# EAGLE design FREZZ_V031 (EAGLE 7.5.0)

## Sheet 1 of 2
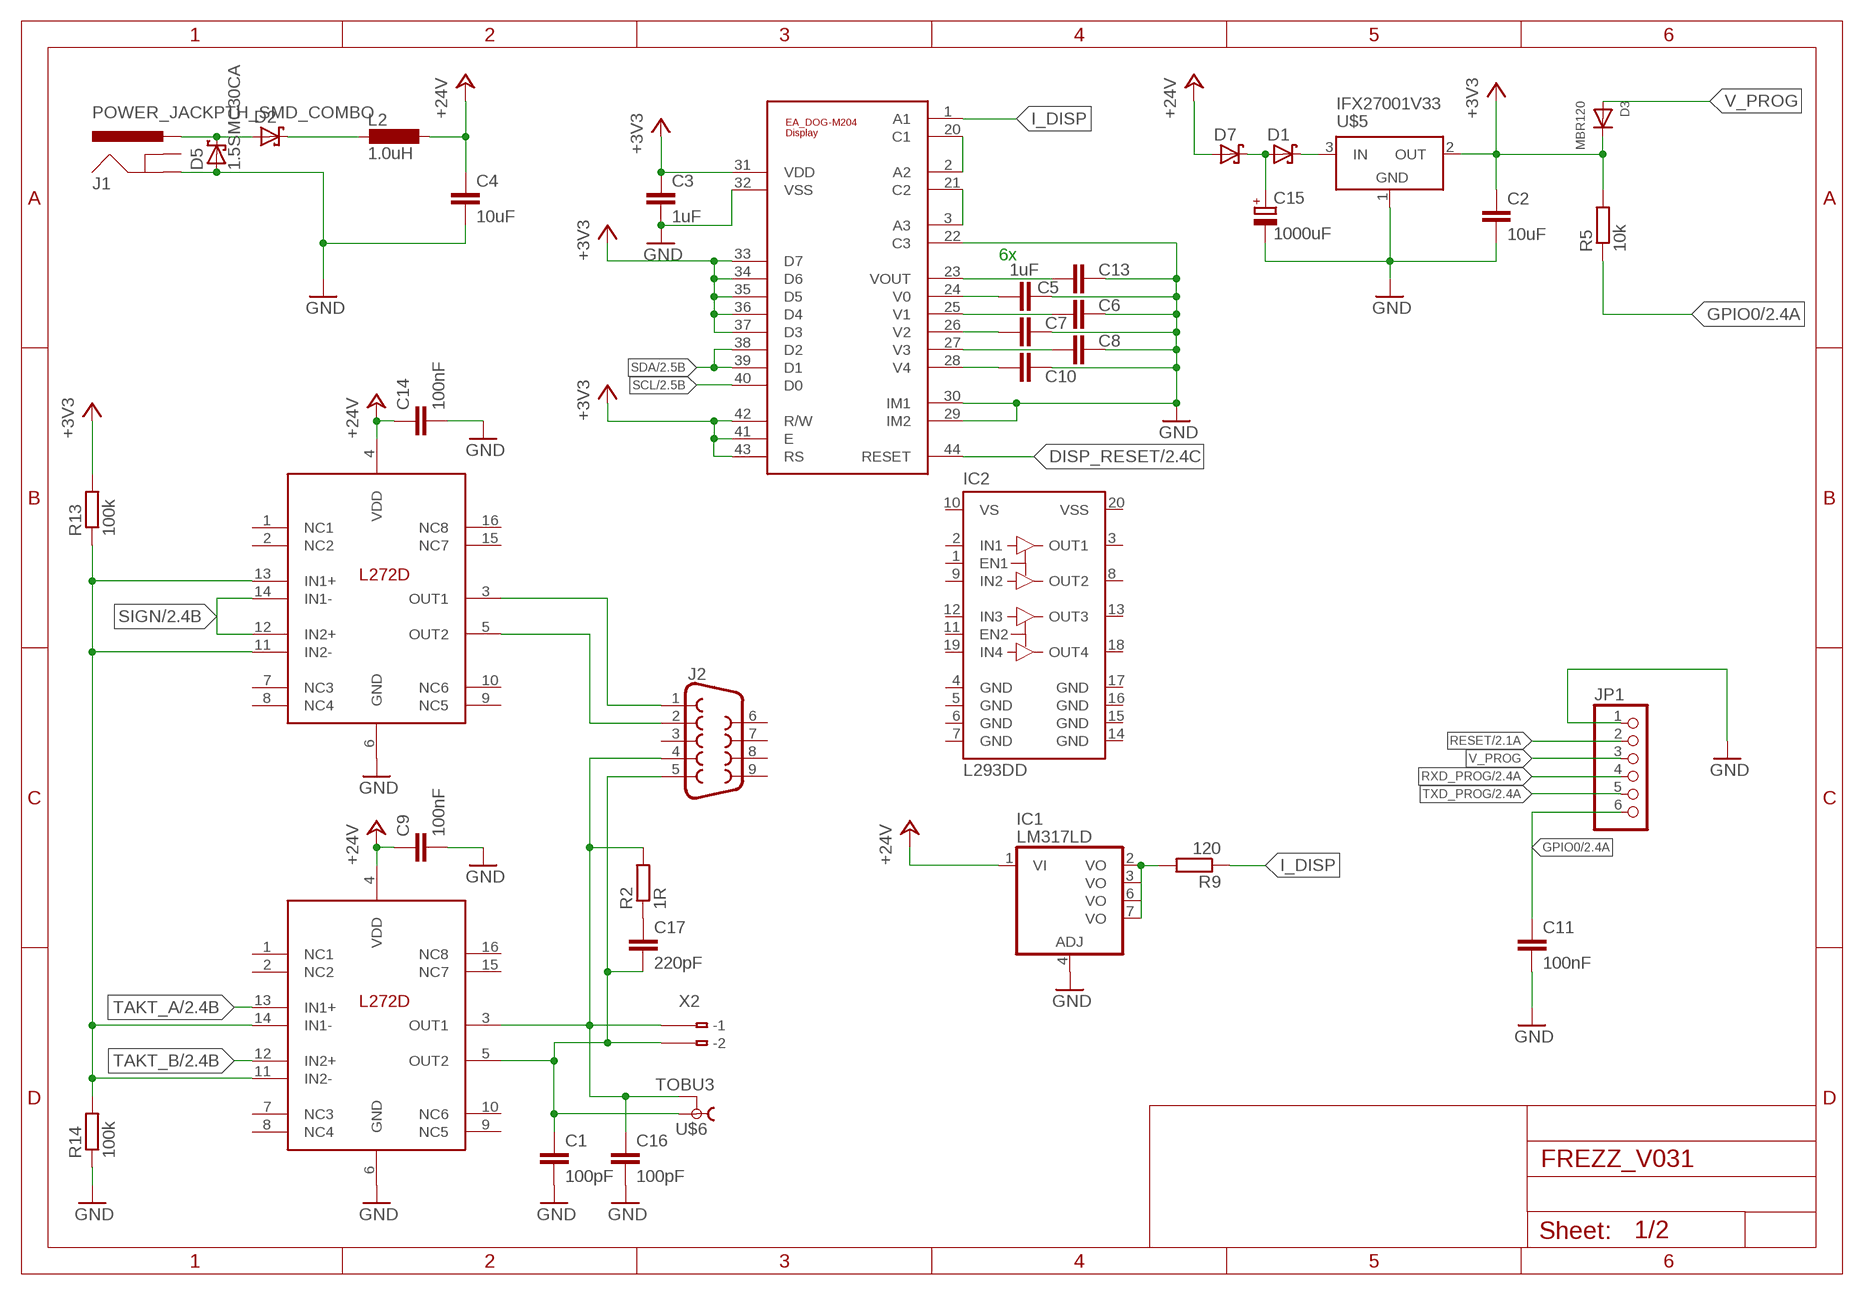
[diagram p0: schematic, sheet 1]

### Parts
C1  100pF  C-EUC0603K  [C0603K]
C2  10uF  C-EUC0603K  [C0603K]
C3  1uF  C-EUC0603K  [C0603K]
C4  10uF  C-EUC1210K  [C1210K]
C5  1uF  C-EUC0603K  [C0603K]
C6  1uF  C-EUC0603K  [C0603K]
C7  1uF  C-EUC0603K  [C0603K]
C8  1uF  C-EUC0603K  [C0603K]
C9  100nF  C-EUC0603K  [C0603K]
C10  1uF  C-EUC0603K  [C0603K]
C11  100nF  C-EUC0603K  [C0603K]
C13  1uF  C-EUC0603K  [C0603K]
C14  100nF  C-EUC0603K  [C0603K]
C15  1000uF  CPOL-EUG  [PANASONIC_G]
C16  100pF  C-EUC0603K  [C0603K]
C17  220pF  C-EUC0603K  [C0603K]
D1  SCHOTTKY-DIODESMD  [SMB]
D2  SCHOTTKY-DIODESMD  [SMB]
D3  MBR120  DIODESOD-123  [SOD-123]
D5  1.5SMC30CA  SCHOTTKY-DIODESMC  [SMC]
D7  SCHOTTKY-DIODESMD  [SMB]
IC1  LM317LD  [SO08]
IC2  L293DD  [SO20]
J1  POWER_JACKPTH_SMD_COMBO  [POWER_JACK_COMBO]
J2  DB9FEMALE  [DB9]
JP1  PINHD-1X6  [1X06]
L2  1.0uH  L-EUL3230M  [L3230M]
R2  1R  R-EU_M1206  [M1206]
R5  10k  R-EU_M1206  [M1206]
R9  120  R-EU_M1206  [M1206]
R13  100k  R-EU_M1206  [M1206]
R14  100k  R-EU_M1206  [M1206]
U$1  EA_DOG-M204-DISPLAY  [E_DOG-M204_DISPLAY]
U$2  L272D  [SO16]
U$3  L272D  [SO16]
U$5  IFX27001V33  IFX27001  [TO252]
U$6  TOBU3  TOBU3-REICHELT  [TOBU3-REICHELT]
X2  233-102  [233-102]

### Nets
$N122 [Power]: D1.C U$5.3(IN)
+3V3 [Power]: C2.1 C3.1 D3.C R5.2 R13.2 U$1.31(VDD) U$1.33(D7) U$1.34(D6) U$1.35(D5) U$1.36(D4) U$1.37(D3) U$1.41(E) U$1.42(R/W) U$1.43(RS) U$5.2(OUT) ; also sheet 2
+24V [Power]: C4.1 C9.1 C14.1 D7.A IC1.1(VI) L2.1 U$2.4(VDD) U$3.4(VDD) ; also sheet 2
DISP_RESET: U$1.44(RESET) ; also sheet 2
GND [Power]: C1.2 C2.2 C3.2 C4.2 C5.1 C6.1 C7.1 C8.1 C9.2 C10.1 C11.2 C13.1 C14.2 C15.- C16.2 D5.A IC1.4(ADJ) J1.GND@1(GND) JP1.1 R14.1 U$1.22(C3) U$1.29(IM2) U$1.30(IM1) U$1.32(VSS) U$2.6(GND) U$3.6(GND) U$5.1(GND) ; also sheet 2
GPIO0: C11.1 JP1.6 R5.1 ; also sheet 2
I_DISP: R9.1 U$1.1(A1)
N$4: C13.2 U$1.23(VOUT)
N$5 [Power]: D2.A D5.C J1.POWER(PWR)
N$6: C5.2 U$1.24(V0)
N$7 [Power]: D2.C L2.2
N$8 [Power]: C15.+ D1.A D7.C
N$9: C17.1 R2.1
N$11 [Power]: C16.1 J2.4 R2.2 U$2.3(OUT1) U$6.2 U$6.2@1 U$6.2@2 X2.B1(B-1)
N$12: C6.2 U$1.25(V1)
N$13 [Power]: C1.1 C17.2 J2.5 U$2.5(OUT2) U$6.1 X2.B2(B-2)
N$15: C7.2 U$1.26(V2)
N$16: C8.2 U$1.27(V3)
N$21: C10.2 U$1.28(V4)
N$22: U$1.3(A3) U$1.21(C2)
N$23: U$1.2(A2) U$1.20(C1)
N$24: IC1.2(VO) IC1.3(VO) IC1.6(VO) IC1.7(VO) R9.2
N$26: J2.1 U$3.3(OUT1)
N$27: J2.2 U$3.5(OUT2)
N$38: R13.1 R14.2 U$2.11(IN2-) U$2.14(IN1-) U$3.11(IN2-) U$3.13(IN1+)
RESET: JP1.2 ; also sheet 2
RXD_PROG: JP1.4 ; also sheet 2
SCL: U$1.40(D0) ; also sheet 2
SDA: U$1.38(D2) U$1.39(D1) ; also sheet 2
SIGN: U$3.12(IN2+) U$3.14(IN1-) ; also sheet 2
TAKT_A: U$2.13(IN1+) ; also sheet 2
TAKT_B: U$2.12(IN2+) ; also sheet 2
TXD_PROG: JP1.5 ; also sheet 2
V_PROG: D3.A JP1.3
Unconnected: IC2.1(EN1) IC2.2(IN1) IC2.3(OUT1) IC2.8(OUT2) IC2.9(IN2) IC2.11(EN2) IC2.12(IN3) IC2.13(OUT3) IC2.18(OUT4) IC2.19(IN4) J1.GND(GNDBREAK) J2.3 J2.6 J2.7 J2.8 J2.9 U$2.1(NC1) U$2.2(NC2) U$2.7(NC3) U$2.8(NC4) U$2.9(NC5) U$2.10(NC6) U$2.15(NC7) U$2.16(NC8) U$3.1(NC1) U$3.2(NC2) U$3.7(NC3) U$3.8(NC4) U$3.9(NC5) U$3.10(NC6) U$3.15(NC7) U$3.16(NC8) X2.A1(-1) X2.A2(-2)

### Notes on the sheet
- 6x

## Sheet 2 of 2
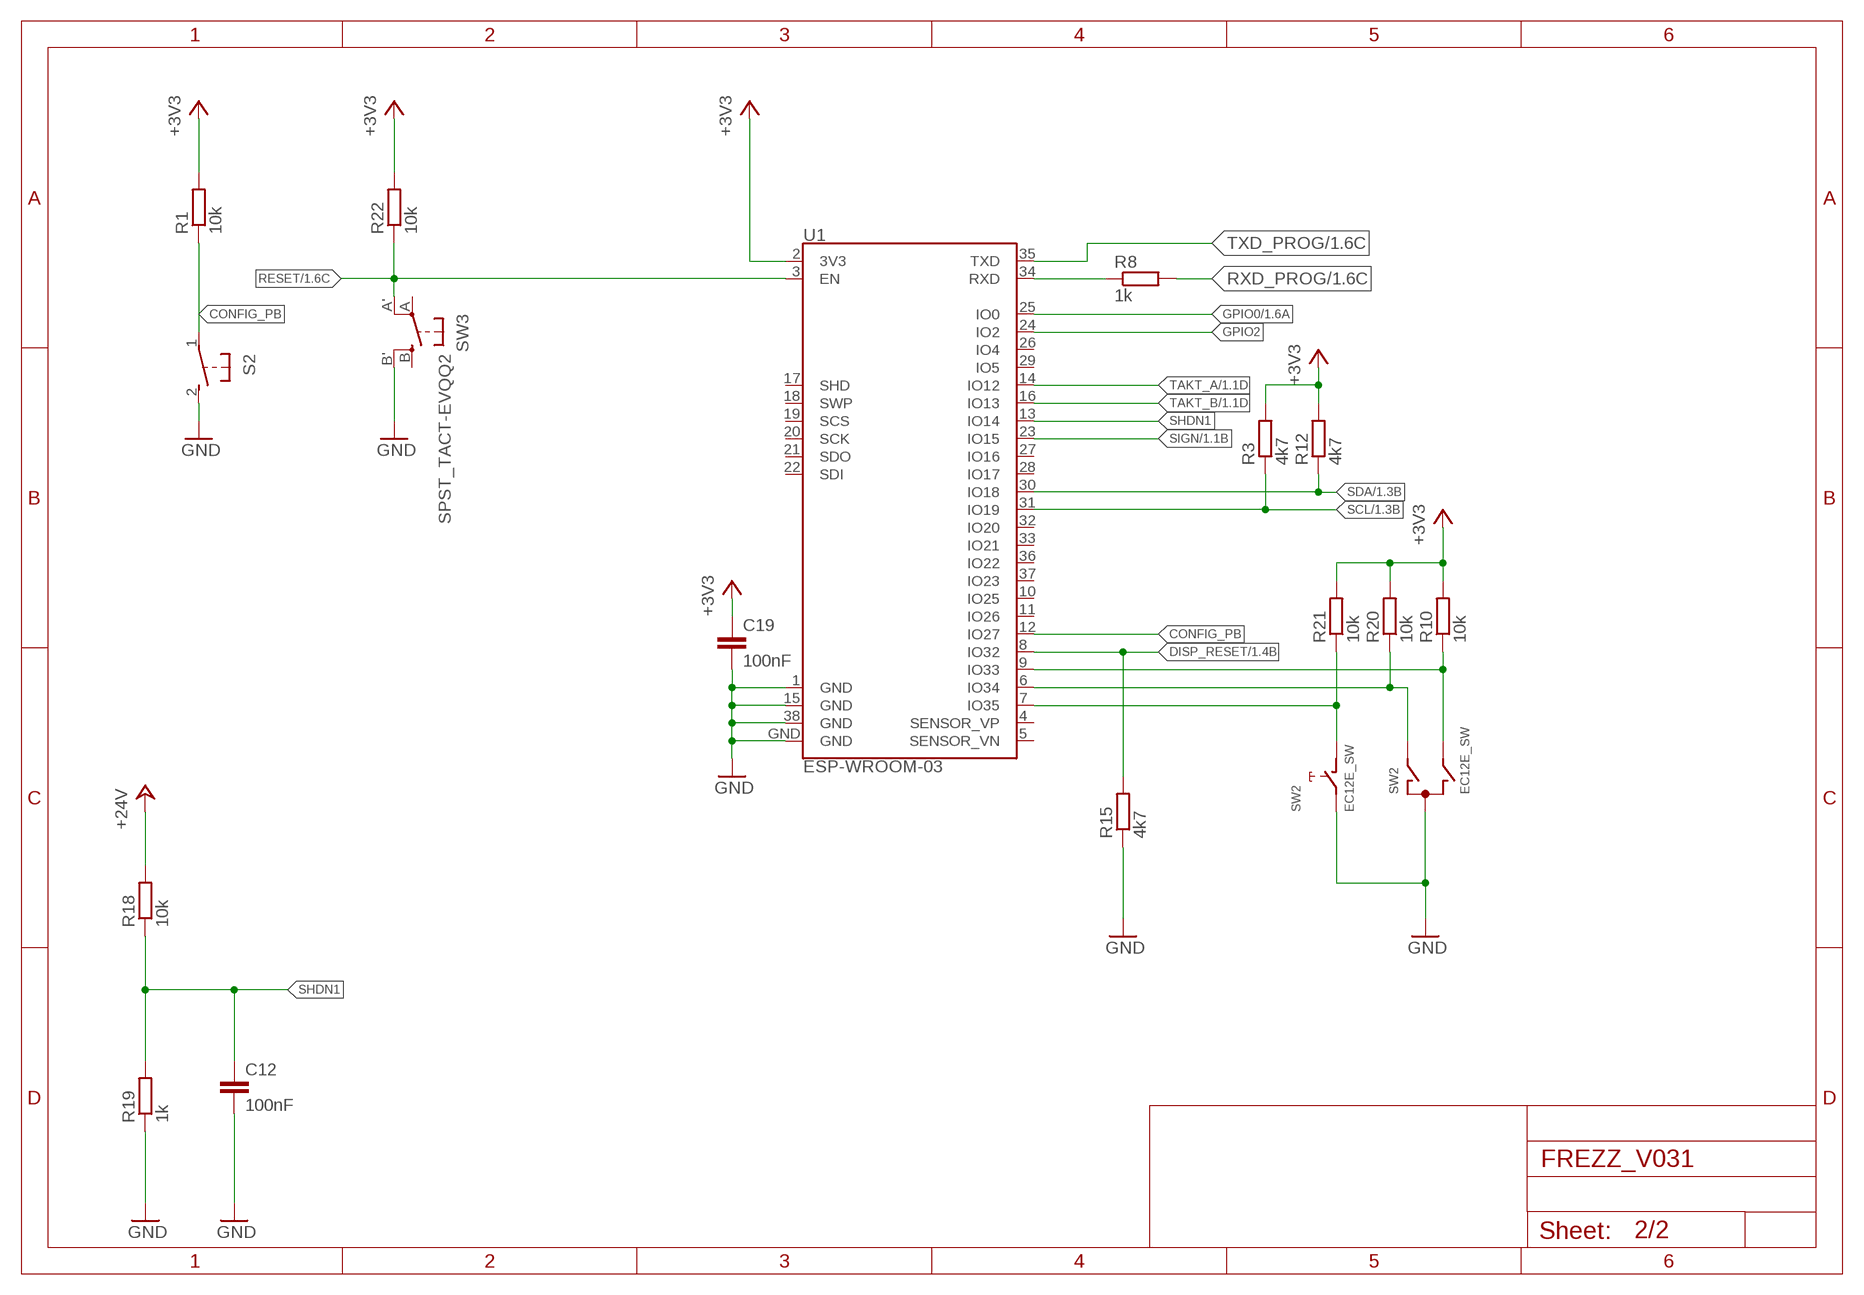
[diagram p1: schematic, sheet 2]

### Parts
C12  100nF  C-EUC0603K  [C0603K]
C19  100nF  C-EUC0603K  [C0603K]
R1  10k  R-EU_M1206  [M1206]
R3  4k7  R-EU_M1206  [M1206]
R8  1k  R-EU_M1206  [M1206]
R10  10k  R-EU_M1206  [M1206]
R12  4k7  R-EU_M1206  [M1206]
R15  4k7  R-EU_M1206  [M1206]
R18  10k  R-EU_M1206  [M1206]
R19  1k  R-EU_M1206  [M1206]
R20  10k  R-EU_M1206  [M1206]
R21  10k  R-EU_M1206  [M1206]
R22  10k  R-EU_M1206  [M1206]
S2  31-XX  [B3F-31XX]
SW2  EC12E_SW  [ALPS_EC12E_SW]
SW3  SPST_TACT-EVQQ2  [EVQ-Q2]
U1  ESP-WROOM-03  [ESP-WROOM-03]

### Nets
+3V3 [Power]: C19.1 R1.2 R3.2 R10.2 R12.2 R20.2 R21.2 R22.2 U1.2(3V3) ; also sheet 1
+24V [Power]: R18.2 ; also sheet 1
CONFIG_PB: R1.1 S2.1(P) U1.12(IO27)
DISP_RESET: R15.2 U1.8(IO32) ; also sheet 1
GND [Power]: C12.2 C19.2 R15.1 R19.1 S2.2(S) SW2.C SW2.E SW3.B'(S1) U1.1(GND) U1.15(GND) U1.38(GND) U1.GND ; also sheet 1
GPIO0: U1.25(IO0) ; also sheet 1
N$31: R21.1 SW2.D U1.7(IO35)
N$33: R8.1 U1.34(RXD)
N$34: R10.1 SW2.B U1.9(IO33)
N$37: R20.1 SW2.A U1.6(IO34)
RESET: R22.1 SW3.A'(P1) U1.3(EN) ; also sheet 1
RXD_PROG: R8.2 ; also sheet 1
SCL: R3.1 U1.31(IO19) ; also sheet 1
SDA: R12.1 U1.30(IO18) ; also sheet 1
SHDN1: C12.1 R18.1 R19.2 U1.13(IO14)
SIGN: U1.23(IO15) ; also sheet 1
TAKT_A: U1.14(IO12) ; also sheet 1
TAKT_B: U1.16(IO13) ; also sheet 1
TXD_PROG: U1.35(TXD) ; also sheet 1
Unconnected: SW2.GND1(G) SW2.GND2(G) SW3.A(P) SW3.B(S) U1.4(SENSOR_VP) U1.5(SENSOR_VN) U1.10(IO25) U1.11(IO26) U1.17(SHD) U1.18(SWP) U1.19(SCS) U1.20(SCK) U1.21(SDO) U1.22(SDI) U1.24(IO2) U1.26(IO4) U1.27(IO16) U1.28(IO17) U1.29(IO5) U1.32(IO20) U1.33(IO21) U1.36(IO22) U1.37(IO23)

## Power pins joined to a net without a drawn wire
GND: IC2.4(GND) IC2.5(GND) IC2.6(GND) IC2.7(GND) IC2.14(GND) IC2.15(GND) IC2.16(GND) IC2.17(GND)
VS: IC2.10(VS)
VSS: IC2.20(VSS)

## Library data of the parts
C1-C14 C16 C17 C19 = rcl:C-EU: CAPACITOR, European symbol
C15 = rcl:CPOL-EU: POLARIZED CAPACITOR, European symbol
D1 D2 D5 D7 = diode:SCHOTTKY-DIODE: Schottky Diode
D3 = adafruit:DIODE: Diode SMADIODE - SMA Surface Mount Package 20V 1A Schottky Diode Digikey: 641-1014-6-ND DO-1N4148 - Through Hole Small Current Diode SOD-123 20V 1 A (.5mV Vf) Schottky Diode - Digikey: MBRX120TPMSCT-ND SOD-323 10V 570mA (.38mV Vf, 3ns) Schottky Diode - Digikey: ZLLS410CT-ND SOD-523 30V 30mA Schottky Diode (RB751S-40TE61) - Digikey: RB751S-40TE61CT-ND SOT23-R/W - SOT23 Package (R = Solder Paste/Reflow Ovens, W = Hand-Soldering) BAT54Film 40V 300mA - Digikey: 497-7162-1-ND
IC1 = linear:LM317LD: LOW CURRENT 1.2 TO 37V ADJUSTABLE VOLTAGE REGULATOR Source: http://pdf.alldatasheet.com
IC2 = st-microelectronics:L293DD: PUSH-PULL FOUR CHANNEL DRIVER WITH DIODES Source: http://www.st.com/stonline/books/pdf/docs/1330.pdf; OC_FARNELL: unknown
J1 = SparkFun-Connectors:POWER_JACK: Power Jack Connector This is the standard 5.5mm barrel jack for power. The PTH is the most common, proven, reliable, footprint. The Slot footprint only works if the mill layer is transmitted to the PCB fab house so be warned. Here are the connectors we sell at SparkFun: DC Barrel Power Jack/Connector <https://www.sparkfun.com/products/119> (PRT-00119) DC Barrel Power Jack/Connector (SMD) <https://www.sparkfun.com/products/12748> (PRT-12748) DC Barrel Jack Adapter - Breadboard Compatible <https://www.sparkfun.com/products/10811> (PRT-10811) It is used on this SparkFun product (and many, many others): SparkFun RedBoard - Programmed with Arduino <https://www.sparkfun.com/products/12757> (DEV-12757) Also, if you need a mating power supply or connector, please check these out: Wall Adapter Power Supply - 9VDC 650mA <https://www.sparkfun.com/products/298> (TOL-00298) DC Barrel Jack Adapter - Male <https://www.sparkfun.com/products/10287> (PRT-10287)
J2 = SparkFun-Connectors:DB9: DB9 Connector Standard DB9 (D-Sub 9) serial connector. Can be used for CAN bus as well as RS485 and RS232. Footprint production proven. Here is the female version connector we sell at SparkFun: 9 Pin Female Serial Connector - PCB Mount <https://www.sparkfun.com/products/429> (PRT-00429) This connector has been used on the following SparkFun products: SparkFun RS232 Shifter - SMD <https://www.sparkfun.com/products/449> (PRT-00449) SparkFun RS232 Shifter SMD (No DB9) <https://www.sparkfun.com/products/8780> (PRT-08780); PROD_ID: CONN-08194
JP1 = adafruit:PINHD-1X6: PIN HEADER
L2 = rcl:L-EU: INDUCTOR, European symbol
R1-R3 R5 R8-R10 R12-R15 R18-R22 = resistor:R-EU_: RESISTOR, European symbol
S2 = switch-omron:31-XX: OMRON SWITCH; MPN: B3F-3100; OC_FARNELL: 959704; OC_NEWARK: 36M3582
SW2 = switch-alps:EC12E_SW: ALPS rotary Encoder EC12E series with switch; MPN: EC12E2424407; OC_FARNELL: 1520813; OC_NEWARK: 74M1068
SW3 = adafruit:SPST_TACT: SMT 6mm switch, EVQQ2 series http://www.ladyada.net/library/eagle
U1 = esp32:ESP-WROOM-03
U$1 = display_ea_dog-m:EA_DOG-M204-DISPLAY
U$2 U$3 = adafruit:L272D
U$5 = MeineLIB:IFX27001
U$6 = con-hirschmann:TOBU3-REICHELT
X2 = con-wago:233-102: WAGO Cage Clamp; MPN: 233-102; OC_FARNELL: unknown; OC_NEWARK: 28K9044

## Net classes
0 default: width 0.102 mm, drill 0.076 mm, clearance 0.051 mm
1 Power: width 1.016 mm, drill 0.076 mm, clearance 0.051 mm to class 0, clearance 0.051 mm
2 24V: width 0.127 mm, drill 0.076 mm, clearance 0.051 mm to class 0, clearance 0.051 mm to class 1, clearance 0.051 mm

## Board
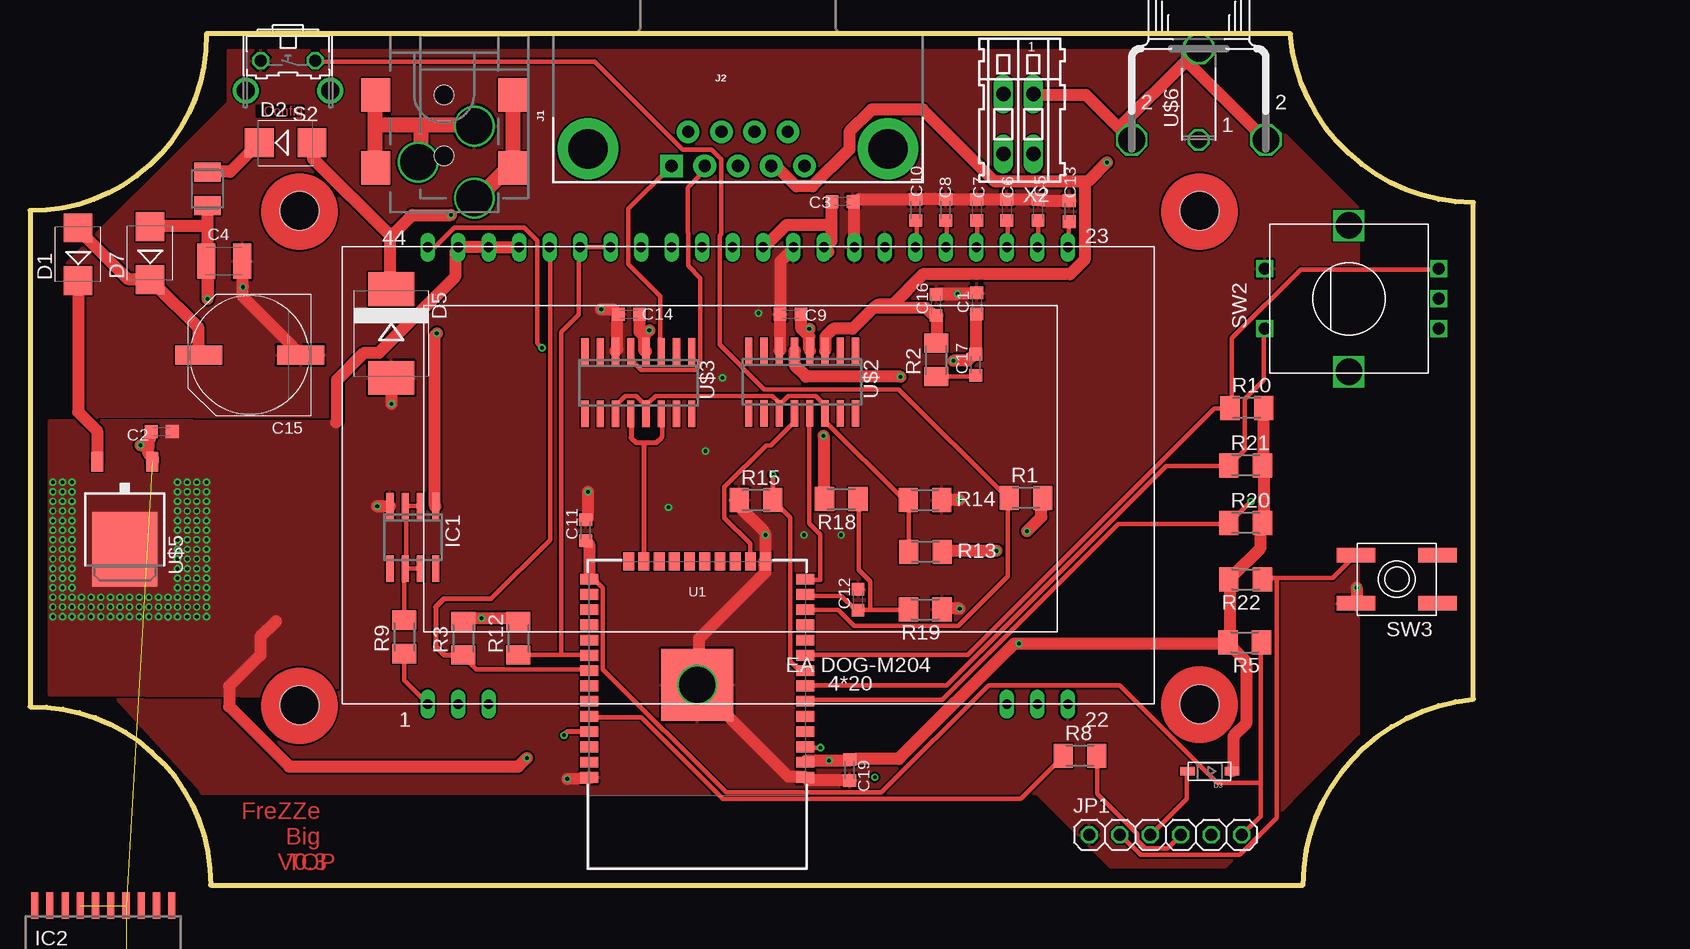
[diagram p2: board, top side]
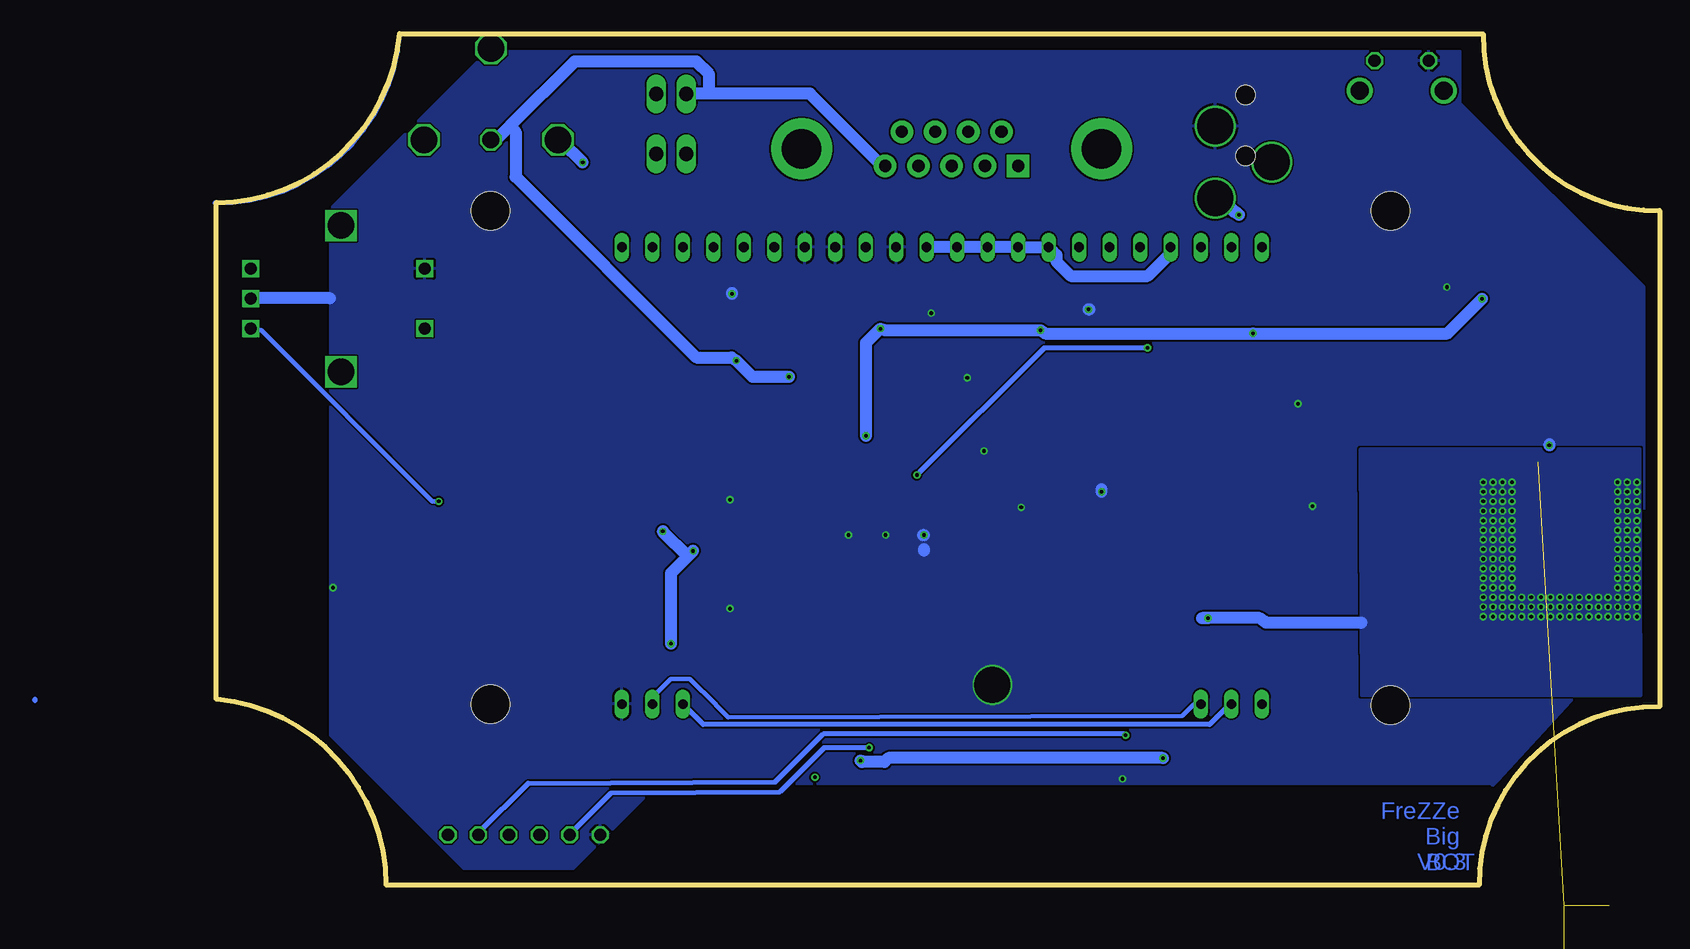
[diagram p3: board, bottom side, seen from below]

Size 120.28 x 71 mm. Coordinates in mm from the lower left corner, seen from the top.
Outline: 106.08,0 15.05,0 arc92 0,14.88 0,56.25 arc92 14.7,70.95
Outline: 120.28,15.49 120.28,56.93
Outline: 105.02,70.98 14.7,70.98
Outline: 120.2,56.9 arc-84 105,71
Outline: 106.1,0 arc-84 120.2,15.5
Copper layers (1+16): Top 0.035mm / dielectric 0.36mm / Bottom 0.035mm
Design rules "PCB-Joker-Eagle-DRU-v1-0 3 *": minimum track width 15mil, minimum drill 0.3mm, track to track 6mil, track to pad 6mil, pad to pad 6mil, via to via 6mil, smd to smd 6mil, copper to edge 0mil, drill to drill 10mil, minimum pad ring 8mil, minimum via ring 6mil, stop-mask expansion 3mil, vias tented up to drill 0mil, thermal gap 8mil
Holes 3.2 mm at 97.45,15.11 97.45,56.21 22.45,56.21 22.45,15.01
tKeepout: area 46.5,0.2 to 64.7,7.9
bKeepout: area 46.5,0.1 to 64.7,7.8; area 96.2,13.8 to 98.7,16.3; area 96.2,54.9 to 98.7,57.4; area 21.2,54.9 to 23.7,57.4; area 21.2,13.7 to 23.7,16.2

### Footprints (pad centres in the part's own frame; a part is rotated, then mirrored left to right if it is on the bottom)
C0603K = smd 1.05 x 1.08: 1 -0.875,0; 2 0.875,0
C1210K = smd 1.5 x 2.9: 1 -1.5,0; 2 1.5,0
PANASONIC_G = smd 3.9 x 1.6: + 4.25,0; - -4.25,0
SMB = smd 2.4 x 2.4: A 2.2,0; C -2.2,0
SOD-123 = smd 1.2 x 0.7: A 1.85,0; C -1.85,0
SMC = smd 2.8 x 3.8: A 3.7,0; C -3.7,0
SO08 = smd 0.6 x 2.2: 1 -1.905,-2.6; 2 -0.635,-2.6; 3 0.635,-2.6; 4 1.905,-2.6; 5 1.905,2.6; 6 0.635,2.6; 7 -0.635,2.6; 8 -1.905,2.6
SO20 = smd 0.6 x 2.2: 1 -5.715,-4.6; 2 -4.445,-4.6; 3 -3.175,-4.6; 4 -1.905,-4.6; 5 -0.635,-4.6; 6 0.635,-4.6; 7 1.905,-4.6; 8 3.175,-4.6; 9 4.445,-4.6; 10 5.715,-4.6; 11 5.715,4.6; 12 4.445,4.6; 13 3.175,4.6; 14 1.905,4.6; 15 0.635,4.6; 16 -0.635,4.6; 17 -1.905,4.6; 18 -3.175,4.6; 19 -4.445,4.6; 20 -5.715,4.6
POWER_JACK_COMBO = drill 2.997: GND 5.62,-2.16; GND@1 2.62,2.54; POWER 8.62,2.54 | smd 2.8 x 2.4: GND@3 0,-5.7; GND@4 6.1,-5.7; POWER@1 0,5.7; POWER@2 6.1,5.7 | hole 1.6: 0,0; 5.08,0
DB9 = drill 1.016 pad 1.88 square: 1 -5.54,-1.42 | drill 1.016 pad 1.88: 2 -2.77,-1.42; 3 0,-1.42; 4 2.77,-1.42; 5 5.54,-1.42; 6 -4.15,1.42; 7 -1.38,1.42; 8 1.38,1.42; 9 4.15,1.42 | drill 3.302 pad 5.08: G1 -12.5,0; G2 12.5,0
1X06 = drill 1.016 octagon: 1 -6.35,0; 2 -3.81,0; 3 -1.27,0; 4 1.27,0; 5 3.81,0; 6 6.35,0
L3230M = smd 1.6 x 2.2: 1 -1.4,0; 2 1.4,0
M1206 = smd 1.6 x 2: 1 -1.4,0; 2 1.4,0
B3F-31XX = drill 1.016 octagon: 1 -2.261,-1.245; 2 2.261,-1.245 | drill 1.499 pad 2.159: 3 -3.505,1.245; 4 3.505,1.245
ALPS_EC12E_SW = drill 1 square: A -2.5,-7.5; B 2.5,-7.5; C 0,-7.5; D -2.5,7; E 2.5,7 | drill 2.2 square: GND1 -6.1,0; GND2 6.1,0
EVQ-Q2 = smd 3.2 x 1.2: A -3.4,-2; A' 3.4,-2; B -3.4,2; B' 3.4,2
ESP-WROOM-03 = smd 0.9 x 1.5: 1 7.7,9; 2 6.43,9; 3 5.16,9; 4 3.89,9; 5 2.62,9; 6 1.35,9; 7 0.08,9; 8 -1.19,9; 9 -2.46,9; 10 -3.73,9; 11 -5,9; 12 -6.27,9; 13 -7.54,9; 14 -8.81,9; 25 -8.81,-9; 26 -7.54,-9; 27 -6.27,-9; 28 -5,-9; 29 -3.73,-9; 30 -2.46,-9; 31 -1.19,-9; 32 0.08,-9; 33 1.35,-9; 34 2.62,-9; 35 3.89,-9; 36 5.16,-9; 37 6.43,-9; 38 7.7,-9 | smd 1.5 x 0.9: 15 -10.3,5.715; 16 -10.3,4.445; 17 -10.3,3.175; 18 -10.3,1.905; 19 -10.3,0.635; 20 -10.3,-0.635; 21 -10.3,-1.905; 22 -10.3,-3.175; 23 -10.3,-4.445; 24 -10.3,-5.715 | smd 6 x 6: GND 0,0
E_DOG-M204_DISPLAY = drill 0.8 long: 1 7.144,0; 2 9.684,0; 3 12.224,0; 20 55.404,0; 21 57.944,0; 22 60.484,0; 23 60.484,38.1; 24 57.944,38.1; 25 55.404,38.1; 26 52.864,38.1; 27 50.324,38.1; 28 47.784,38.1; 29 45.244,38.1; 30 42.704,38.1; 31 40.164,38.1; 32 37.624,38.1; 33 35.084,38.1; 34 32.544,38.1; 35 30.004,38.1; 36 27.464,38.1; 37 24.924,38.1; 38 22.384,38.1; 39 19.844,38.1; 40 17.304,38.1; 41 14.764,38.1; 42 12.224,38.1; 43 9.684,38.1; 44 7.144,38.1
SO16 = smd 0.6 x 2.2: 1 -4.445,-2.6; 2 -3.175,-2.6; 3 -1.905,-2.6; 4 -0.635,-2.6; 5 0.635,-2.6; 6 1.905,-2.6; 7 3.175,-2.6; 8 4.445,-2.6; 9 4.445,2.6; 10 3.175,2.6; 11 1.905,2.6; 12 0.635,2.6; 13 -0.635,2.6; 14 -1.905,2.6; 15 -3.175,2.6; 16 -4.445,2.6
TO252 = smd 1 x 1.6: 1 -2.28,-4.8; 3 2.28,-4.8 | smd 5.4 x 6.2: 2 0,2.5
TOBU3-REICHELT = drill 1.397 octagon: 1 0,-3.81 | drill 2.21 octagon: 2 5.588,-3.81; 2@1 -5.588,-3.81; 2@2 0,3.81
233-102 = drill 1.2 long: A1 -1.25,2.5; A2 1.25,2.5; B1 -1.25,-2.5; B2 1.25,-2.5

### Placement (x,y rotation side)
C1  78.9,48.5 90 top
C2  10.98,37.82 180 top
C3  67.7,57 0 top
C4  16.18,52.02 0 top
C5  84,56.3 270 top
C6  81.4,56.3 270 top
C7  78.9,56.3 270 top
C8  76.3,56.3 270 top
C9  63.38,47.6 180 top
C10  73.8,56.3 270 top
C11  46.3,29.6 90 top
C12  69,23.8 90 top
C13  86.6,56.2 270 top
C14  49.9,47.6 180 top
C15  18.3,44.2 180 top
C16  75.5,48.4 90 top
C17  78.8,43.4 90 top
C19  68.3,9.6 270 top
D1  4,52.6 90 top
D2  21.3,61.9 0 top
D3  98.3,9.5 180 top
D5  30.1,46 270 top
D7  10,52.7 90 top
IC1  31.9,29 180 top
IC2  6.1,-6.3 0 top
J1  34.5,65.9 270 top
J2  59,61.4 0 top
JP1  94.62,4.19 0 top
L2  14.78,58.05 90 top
R1  83,32.3 0 top
R2  75.5,43.8 90 top
R3  36.1,20.6 90 top
R5  101.22,20.25 180 top
R8  87.5,10.8 0 top
R9  31.2,20.7 90 top
R10  101.4,39.8 0 top
R12  40.7,20.6 90 top
R13  74.62,27.8 0 top
R14  74.58,32.13 180 top
R15  60.5,32.1 0 top
R18  67.6,32.2 180 top
R19  74.6,23 180 top
R20  101.3,30.2 0 top
R21  101.3,35 0 top
R22  101.3,25.5 180 top
S2  21.5,67.5 180 top
SW2  109.9,48.9 90 top
SW3  113.9,25.5 180 top
U1  55.6,16.7 270 top
U$1  26,15.1 0 top
U$2  64.35,41.96 180 top
U$3  50.7,41.9 180 top
U$5  7.9,30.5 180 top
U$6  97.4,65.95 0 top
X2  82.37,63.47 180 top

### Tracks (layer width: path | path; a pad name or v marks a point on that pad's centre or on a via)
$N122
  Top 0.381: 5.6,35.34 U$5.3 | 4,50.27 D1.C
  Top 1.016: 5.6,35.34 5.6,37.87 4,39.47 4,50.27
+3V3  (via drill 0.3, 0.6)
  Top 1.016: U1.2 64.67,10.4 v66.6,10.4 68.28,10.4 C19.1 68.81,10.54 72.41,10.54 82.01,20.14 v82.4,20.14 99.35,20.14 R5.2 | D3.C 100.28,9.6 100.28,12.4 101.35,13.47 101.35,18.67 99.88,20.14 R5.2 | U$1.41 40.67,53.21 38.67,53.21 U$1.42 38.14,53.21 35.74,53.21 U$1.43 35.47,52.81 35.47,50.81 29.07,44.41 27.87,44.41 25.6,42.14 25.6,38.67 25.5,38.6 | 36.01,22 R3.2 36.37,22.27 v37.64,22.27 40.43,22.27 R12.2 | 40.67,22 R12.2 | 66.81,55.07 66.81,53.74 66.28,53.21 U$1.31 66.54,52.81 | 66.81,55.07 66.81,56.94 C3.1 | v61.07,53.21 U$1.33 61.47,53.47 63.08,55.07 66.81,55.07 | v80.54,27.87 76.14,27.87 R13.2 | 20.5,22 19.2,20.7 19.2,19.2 16.6,16.6 16.6,14.9 21.6,9.9 40.7,9.9 v41.4,10.6 | R12.2 | R10.2 102.81,39.74 102.81,35.47 R21.2 102.81,34.94 102.81,30.27 R20.2 102.55,29.74 102.55,28.14 100.28,25.87 R22.2 100.01,25.47 100.01,20.67 R5.2 | v83.08,29.5 84.28,30.7 84.28,32.27 R1.2
  Bottom 1.016: 24.83,21.87 24.94,21.87 32.8,21.87 32.94,22 33.34,22.27 38.14,22.27 v37.64,22.27 | v61.07,53.21 59.07,53.21 U$1.34 56.41,53.21 U$1.35 55.87,53.21 53.87,53.21 U$1.36 53.34,53.21 50.94,53.21 U$1.37 50.81,53.07 50.27,52.54 50.27,52.01 49.07,50.81 42.67,50.81 40.8,52.67 40.8,53.07 U$1.41 | v41.4,10.6 64.27,10.6 U1.2 66.47,10.27 v66.6,10.4 | v80.54,27.87 81.01,27.4 | 81.01,27.4 82.4,26.01 v82.4,20.14 | v83.08,29.5 83.08,29.47 81.01,27.4
  other vias: 12.3,24 10.7,24 9.9,24 11.5,24 12.3,24.8 12.3,25.6 13.1,25.6 13.1,24.8 13.1,24 12.3,26.4 12.3,27.2 12.3,28 13.1,28 13.1,27.2 13.1,26.4 12.3,28.8 12.3,29.6 12.3,30.4 13.1,30.4 13.1,29.6 13.1,28.8 12.3,31.2 12.3,32 12.3,32.8 13.1,32.8 13.1,32 13.1,31.2 12.3,33.6 13.1,33.6 13.9,33.6 14.7,33.6 13.9,31.2 13.9,32 13.9,32.8 14.7,32.8 14.7,32 14.7,31.2 13.9,28.8 13.9,29.6 13.9,30.4 14.7,30.4 14.7,29.6 14.7,28.8 13.9,26.4 13.9,27.2 13.9,28 14.7,28 14.7,27.2 14.7,26.4 13.9,24 13.9,24.8 13.9,25.6 14.7,25.6 14.7,24.8 14.7,24 14.7,22.4 13.9,22.4 13.1,22.4 13.1,23.2 13.9,23.2 14.7,23.2 6.7,23.2 5.9,23.2 5.1,23.2 5.1,24 5.9,24 6.7,24 4.3,24 3.5,24 4.3,23.2 9.9,23.2 9.9,22.4 9.1,22.4 8.3,22.4 7.5,22.4 6.7,22.4 5.9,22.4 5.1,22.4 4.3,22.4 3.5,22.4 3.5,23.2 2.7,23.2 2.7,24 2.7,22.4 12.3,22.4 11.5,22.4 10.7,22.4 10.7,23.2 11.5,23.2 12.3,23.2 9.1,23.2 8.3,23.2 7.5,23.2 7.5,24 8.3,24 9.1,24 2.7,24.8 2.7,25.6 2.7,26.4 3.5,26.4 3.5,25.6 3.5,24.8 2.7,27.2 2.7,28 2.7,28.8 3.5,28.8 3.5,28 3.5,27.2 2.7,29.6 2.7,30.4 2.7,31.2 3.5,31.2 3.5,30.4 3.5,29.6 2.7,32 2.7,32.8 2.7,33.6 3.5,33.6 3.5,32.8 3.5,32 1.9,23.2 1.9,24 1.9,22.4 1.9,24.8 1.9,25.6 1.9,26.4 1.9,27.2 1.9,28 1.9,28.8 1.9,29.6 1.9,30.4 1.9,31.2 1.9,32 1.9,32.8 1.9,33.6
  pour Bottom (no thermals): 24.9,36.3 24.8,15.9 1.6,15.9 1.7,36.3
  pour Top (no thermals): 25.5,38.6 25.5,15.8 1.7,15.9 1.7,38.7
+24V  (via drill 0.3)
  Top 1.016: 51.14,45.81 51.21,45.74 51.21,44.54 U$3.4 | 51.14,45.81 50.81,46.14 50.81,47.47 C14.1 | 64.61,46.07 64.94,45.74 64.94,44.67 U$2.4 | 64.61,46.07 64.28,46.41 64.28,47.47 C9.1 | v66.14,37.47 66.14,32.27 R18.2 | v64.94,46.41 64.61,46.07 | v51.61,46.27 51.14,45.81 | IC1.1 33.74,31.6 33.74,45.84 v33.9,46.01 | C4.1 14.8,52.01 v14.8,48.9 14.8,51.9 C4.1 | 14.8,54.94 14.8,52.41 C4.1 | 14.8,54.94 14.8,56.54 L2.1 | 14.8,54.94 10,54.94 D7.A
  Bottom 1.016: v66.14,37.47 66.14,45.21 v64.94,46.41 64.54,46.27 v51.61,46.27 51.21,46.01 v33.9,46.01 17.7,46.01 v14.8,48.9
CONFIG_PB
  Top 0.381: U1.12 64.67,22.94 67.34,22.94 68.67,21.6 77.34,21.6 81.48,25.74 81.48,32.27 R1.1 81.34,32.4 72.41,41.34 61.21,41.34 57.47,45.07 57.47,54.14 57.61,54.27 57.61,60.54 56.81,61.34 54.41,61.34 47.07,68.67 23.87,68.67 S2.1
DISP_RESET  (via drill 0.3)
  Top 0.381: U1.8 64.54,18 64.01,18 63.34,18.67 63.34,30.67 62.01,32 R15.2 | v42.67,44.81 42.27,45.21 42.27,53.74 41.2,54.81 35.34,54.81 33.74,53.21 33.2,53.21 U$1.44
  Top 0.406: v61.9,34.2 R15.2
  Bottom 0.406: v42.67,44.81 51.29,44.81 v61.9,34.2
GND  (via drill 0.3, 3)  (8 unrouted)
  Top 0.406: U$3.6 48.9,44.6 48.9,47.7
  Top 1.016: C19.2 68.28,8.8 64.81,8.8 64.67,8.93 U1.1 64.14,9.07 63.21,9.07 55.61,16.67 U1.GND 55.74,17.2 55.74,20.54 61.21,26 | C14.2 48.94,47.47 48.94,44.67 48.81,44.54 U$3.6 | 61.21,26 61.21,26.54 U1.15 61.21,27.07 61.3,27.16 | C4.2 17.74,52.01 v17.74,49.87 17.74,49.07 22.54,44.27 C15.- | C13.1 86.54,57.07 84.41,57.07 C5.1 83.88,57.21 81.88,57.21 C6.1 81.34,57.21 79.34,57.21 C7.1 78.81,57.21 76.81,57.21 C8.1 76.28,57.21 73.88,57.21 C10.1 73.34,57.21 69.08,57.21 C3.2 68.67,56.94 68.67,53.21 U$1.30 | 75.88,22.94 R19.1 76.41,23.07 v77.48,23.07 | U$2.6 62.54,44.67 62.54,47.47 C9.2 62.54,48.14 62.54,52.01 63.61,53.07 U$1.32 | 9.87,36.67 9.87,36.01 10.27,35.6 10.27,35.34 U$5.1 | 9.87,36.67 9.87,37.07 10,37.2 10,37.74 C2.2 | C1.2 78.81,49.34 75.61,49.34 C16.2 75.78,49.27 75.8,49.3 v77.3,49.3 | v44.77,8.87 46.67,8.93 U1.38 | v77.48,32.14 76.01,32.14 R14.1 | v28.94,31.6 29.87,31.6 IC1.4 | v9.2,36.67 9.87,36.67 | v30.14,40.14 30.14,42.27 D5.A | 48.9,47.7 48.6,48 v47.6,48 | 61.21,26 61.3,26.1 61.3,27.16 | 61.3,27.16 v61.3,29.2 61.07,29.6 59.21,31.47 59.21,32 R15.1 | C11.2 46.5,30.68 v46.5,32.8 | v110.55,24.8 110.55,23.6 SW3.B'
  Bottom 1.016: v9.2,36.67 9.2,36.78 | 110.8,48.94 117.35,48.94 SW2.C | v47.6,48 47.5,48 | v61.3,29.2 61.4,29.2 | 61.3,27.9 61.3,28 | v77.3,49.3 77.3,49.4 | v46.5,32.8 46.5,33
  other vias: 56.3,36.2 53.2,31.5 64.5,29.2 67.6,29.2 55.6,16.7 60.7,47.7 57.7,42.3
  pour Bottom (rank 6): 16.6,69.5 97.7,69.5 110.8,56.4 110.8,12.5 99.7,1.4 90.5,1.4 83.4,8.5 14.1,8.5 13.9,8.3 13.5,8.7 1.3,22 1.3,49.9 16.6,65.2
  pour Top (rank 6): 16.5,69.6 97.6,69.6 110.7,56.5 110.7,12.6 99.6,1.5 90,1.5 83.9,7.6 14.4,7.6 14.2,7.8 14.4,7.7 1.2,22.1 1.2,50 16.5,65.3
GPIO0
  Top 0.381: 102.55,8.53 102.55,5.73 101.08,4.27 JP1.6 | 102.55,8.53 102.55,20.14 R5.1 | 102.55,8.53 98.95,8.53 90.81,16.67 79.88,16.67 70.94,7.73 58.01,7.73 47.74,18 47.74,24.8 46.81,25.74 U1.25
  Top 1.016: C11.1 46.6,28.43 U1.25
I_DISP
  Top 0.381: R9.1 31.2,19.2 31.2,17.07 33.07,15.2 U$1.1
N$1  (via drill 0.3)
  other vias: 70.4,9
N$4
  Top 0.381: C13.2 86.54,55.21 86.54,53.21 U$1.23
N$5  (via drill 0.3)
  Top 1.016: 30,54.14 23.6,60.54 23.6,61.87 D2.A | 30,54.14 30,49.74 D5.C | v35.07,55.87 31.87,55.87 30.4,54.41 30,54.14
  Bottom 1.016: v35.07,55.87 35.34,56.14 35.47,56.14 36.54,57.21 36.94,57.21 J1.POWER
N$6
  Top 0.381: C5.2 84.01,55.34 84.01,53.21 U$1.24
N$7
  Top 1.016: L2.2 14.8,59.47 16.67,59.47 19.07,61.87 D2.C
N$8
  Top 1.016: D1.A 4,54.67 8.13,50.54 9.87,50.54 D7.C 10.4,50.14 14,46.54 14,44.27 C15.+
N$9
  Top 0.381: C17.1 78.68,42.41 75.61,42.41 R2.1
N$11  (via drill 0.3)
  Top 1.016: R2.2 75.61,45.21 75.61,47.47 C16.1 75.08,47.74 74.68,48.14 70.28,48.14 | 70.28,48.14 68.54,46.41 66.94,46.41 66.28,45.74 66.28,44.67 U$2.3 | 90.75,63.14 91.75,62.14 U$6.2@1 | 90.75,63.14 88.01,65.88 83.74,65.88 X2.B1 | 87.88,58.67 88.14,58.67 v89.75,60.27 | 87.88,58.67 80.41,58.67 74.41,64.67 70.14,64.67 68.28,62.81 68.28,61.34 65.21,58.27 63.88,58.27 62.27,59.87 61.87,59.87 J2.4 | 90.75,63.14 96.34,68.74 | 96.34,68.74 97.35,69.74 U$6.2@2 | 96.34,68.74 102.95,62.14 U$6.2 | 87.88,58.67 87.88,52.14 86.68,50.94 74.41,50.94 71.88,48.41 70.67,48.41 70.28,48.14
  Bottom 1.016: v89.75,60.27 91.48,62.01 91.75,62.01 U$6.2@1
N$12
  Top 0.381: C6.2 81.48,55.34 81.48,53.21 U$1.25
N$13  (via drill 0.3)
  Top 1.016: C1.1 78.81,47.61 78.81,44.41 C17.2 78.41,44.01 78.14,43.74 v76.94,43.74 | v72.54,42.41 64.67,42.41 63.74,43.34 63.74,44.54 U$2.5
  Bottom 1.016: v72.54,42.41 75.61,42.41 v76.94,43.74 77.34,44.01 80.28,44.01 95.34,59.07 95.34,62.81 95.81,63.27 | 79.21,66.01 70.81,66.01 64.81,60.01 64.54,60.01 J2.5 | 79.21,66.01 81.08,66.01 X2.B2 | 95.81,63.27 90.41,68.67 80.28,68.67 79.21,67.61 79.21,66.01 | 95.81,63.27 96.94,62.14 97.35,62.14 U$6.1
N$15
  Top 0.381: C7.2 78.94,55.34 78.94,53.21 U$1.26
N$16
  Top 0.381: C8.2 76.41,55.34 76.41,53.21 U$1.27
N$19
  Bottom 0.406: 135.4,15.4 135.4,15.5
N$21
  Top 0.381: C10.2 73.88,55.34 73.88,53.21 U$1.28
N$22
  Bottom 0.381: U$1.3 38.27,15.07 38.83,15.07 39.8,14.1 77.6,14 78.6,15 78.68,15.07 80.81,17.2 82.41,17.2 83.88,15.73 83.88,15.2 U$1.21
N$23
  Bottom 0.406: U$1.2 35.8,15.1 37.5,13.4 79.7,13.4 U$1.20
N$24
  Top 0.381: IC1.2 32.4,31.6 31.34,31.6 IC1.3 31.34,31.47 31.34,26.54 IC1.6 | R9.2 31.2,22.14 31.2,26.27 IC1.6 | IC1.7 32.4,26.4 31.34,26.4 IC1.6
N$25
  Bottom 0.406: 120.4,56.9 arc-86 105,70.9
N$26
  Top 0.381: U$3.3 52.54,44.54 52.54,49.11 49.87,51.77 49.87,56.41 53.34,59.87 J2.1
N$27
  Top 0.381: U$3.5 50.14,44.41 50.14,43.74 50.94,42.94 55.47,42.94 55.87,43.34 55.87,50.61 54.84,51.64 54.84,54.37 54.81,54.41 54.81,58.14 55.74,59.07 55.74,59.21 56.14,59.61 56.14,59.87 J2.2
N$31
  Top 0.381: U1.7 64.67,16.67 76.41,16.67 94.68,34.94 99.88,34.94 R21.1 100.01,35.07 101.21,36.27 101.21,40.54 102.81,42.14 102.81,46.27 SW2.D
N$33
  Top 0.381: U1.34 46.67,14 50.94,14 57.74,7.2 82.54,7.2 86.01,10.67 R8.1
N$34
  Top 0.381: U1.9 64.67,19.2 78.14,19.2 98.68,39.74 99.88,39.74 R10.1 100.15,39.87 100.15,45.61 105.88,51.34 117.35,51.34 SW2.B
N$37  (via drill 0.3)
  Top 0.381: U1.6 64.67,15.47 76.01,15.47 90.68,30.14 99.88,30.14 R20.1 100.01,30.27 v101.75,32
  Bottom 0.381: v101.75,32 102.28,32 116.55,46.27 117.35,46.27 SW2.A
N$38
  Top 0.381: R13.1 73.21,27.87 73.21,32 R14.2 73.08,32.27 72.68,32.27 66.28,38.67 66.28,39.2 U$2.14 66.14,39.47 66.14,40.14 65.47,40.8 63.21,40.8 62.54,40.14 62.54,39.47 U$2.11 62.41,40.27 61.87,40.8 52.14,40.8 51.61,40.27 51.34,40.27 U$3.13 51.21,39.34 51.21,40.14 50.54,40.8 49.61,40.8 48.81,40.01 48.81,39.34 U$3.11
RESET  (via drill 0.3)
  Top 0.381: 103.88,25.6 108.55,25.6 110.41,27.47 SW3.A' | 103.88,25.6 102.81,25.6 R22.1 | v65.88,11.47 64.67,11.47 U1.3 | 103.88,25.6 103.88,5.6 100.81,2.53 92.55,2.53 90.94,4.13 JP1.2
  Bottom 0.381: 90.94,4.13 JP1.2
  Bottom 0.406: 90.94,4.13 87.38,7.7 73.3,7.8 69.63,11.47 v65.88,11.47
RXD_PROG
  Top 0.381: R8.2 88.94,10.67 88.94,7.6 92.28,4.27 92.28,3.73 92.94,3.07 94.81,3.07 95.88,4.13 JP1.4
SCL
  Top 0.381: U1.31 46.54,18 37.2,18 36.14,19.07 R3.1 | 38.41,23.87 43.34,28.8 43.34,53.07 U$1.40
  Top 0.406: 38.41,23.87 34.47,23.87 33.8,23.2 33.8,19.9 34.5,19.2 R3.1
SDA
  Top 0.381: U$1.38 48.27,53.21 45.87,53.21 U$1.39 45.74,53.07 45.74,47.57 44.27,46.11 44.27,19.2 | 44.27,19.2 40.8,19.2 R12.1 | 44.27,19.2 46.54,19.2 U1.30
SHDN1
  Top 0.381: 70.01,22.94 73.08,22.94 R19.2 | 70.01,22.94 69.08,22.94 C12.1 68.81,22.94 67.61,24.14 64.67,24.14 U1.13 | 70.01,22.94 70.01,25.34 69.08,26.27 69.08,32.14 R18.1
SIGN
  Top 0.381: U$3.12 50.14,39.34 50.1,39.27 | 52.6,37.3 52.67,37.47 52.67,39.2 U$3.14
  Top 0.406: 50.1,39.27 50.1,37.3 50.5,36.9 51.1,36.9 | 51.1,36.9 52.2,36.9 52.6,37.3 | 51.1,36.9 51.16,36.84 U1.23
TAKT_A
  Top 0.381: U1.14 64.67,25.47 65.34,25.47 65.88,25.44 65.88,29.24 64.94,30.17 64.94,39.34 U$2.13
TAKT_B
  Top 0.381: U1.16 60.01,27.07 60.01,28.5 57.87,30.64 57.87,33.2 61.34,36.67 61.74,36.67 63.61,38.54 63.61,39.34 U$2.12
TXD_PROG  (via drill 0.3)
  Top 0.406: v44.5,12.5 44.81,12.81 U1.35
  Bottom 0.406: JP1.5 98.44,4.37 94.3,8.5 73.7,8.6 69.7,12.6 44.6,12.6 v44.5,12.5
V_PROG
  Top 0.381: D3.A 96.41,9.47 96.41,7.2 93.48,4.27 JP1.3
(copper drawn outside any net)
  shapes: Top circle x4

### Text on the board
Top: Config | FreZZe / Big / V0.3 | TOP
Bottom: FreZZe / Big / V0.3 | BOT
200bmp: /Users/michl/Desktop/ei500.bmp